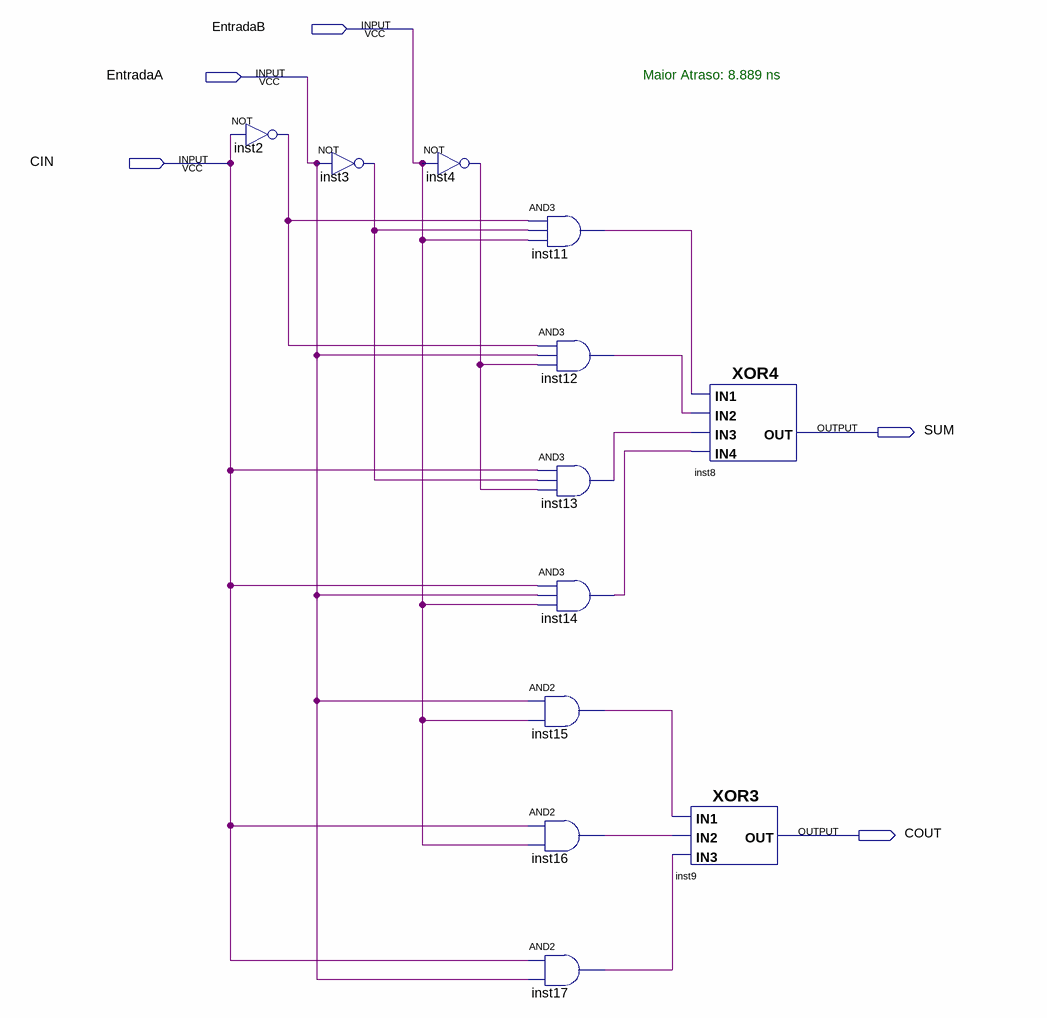
[diagram p0: schematic sheet]
// Quartus schematic FullAdder_1bit.bdf as structural Verilog: 12 symbols, 5 pins
module FullAdder_1bit (
  input  EntradaB,
  input  EntradaA,
  input  CIN,
  output SUM,
  output COUT
);

  wire inst2_out, inst3_out, inst4_out, inst11_out, inst12_out, inst13_out, inst14_out, inst15_out,
       inst16_out, inst17_out;

  not inst2 (inst2_out, CIN);
  not inst3 (inst3_out, EntradaA);
  not inst4 (inst4_out, EntradaB);
  and inst11 (inst11_out, inst2_out, inst3_out, EntradaB);
  and inst12 (inst12_out, inst2_out, EntradaA, inst4_out);
  and inst13 (inst13_out, CIN, inst3_out, inst4_out);
  and inst14 (inst14_out, CIN, EntradaA, EntradaB);
  and inst15 (inst15_out, EntradaA, EntradaB);
  and inst16 (inst16_out, CIN, EntradaB);
  and inst17 (inst17_out, CIN, EntradaA);
  XOR4 inst8 (.IN3(inst13_out), .IN4(inst14_out), .IN2(inst12_out), .IN1(inst11_out), .OUT(SUM));
  XOR3 inst9 (.IN3(inst17_out), .IN1(inst15_out), .IN2(inst16_out), .OUT(COUT));

  // Notes on the sheet:
  //   Maior Atraso: 8.889 ns
endmodule
